# EAGLE design 1606_lora_module (EAGLE 9.6.2)
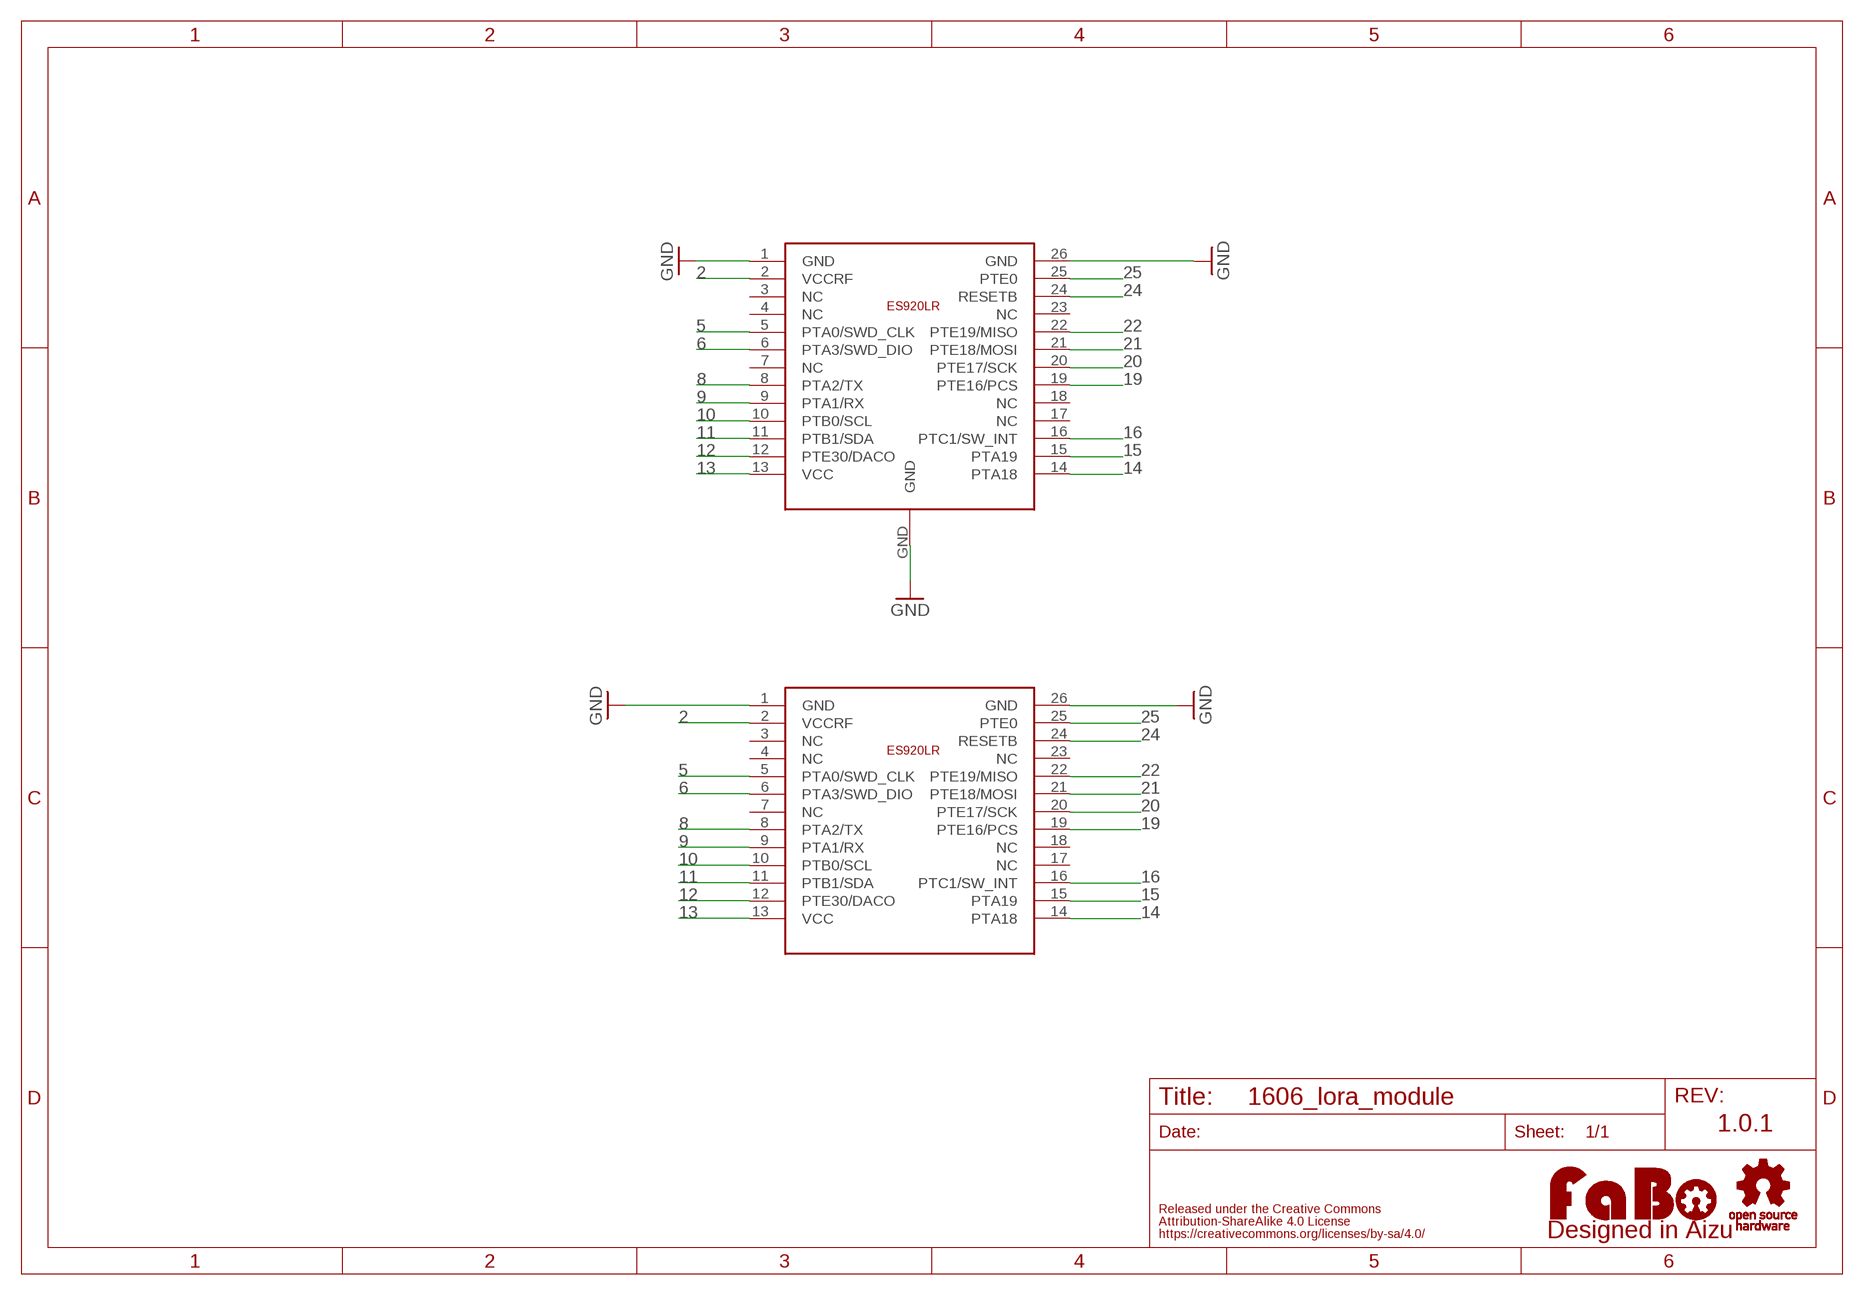
[diagram p0: schematic, sheet 1]

## Parts
U$2  ES920LR  [ES920LR]
U$3  ES920LR_MODULE  [MODULE]
U$4  LOGO_OSHW-M_BOTTOM  [LOGO_OSHW_M_BOTTOM]
U$5  LOGO_FABO-M_BOTTOM  [LOGO_FABO_MS_BOTTOM]

## Nets
2: U$2.2(VCCRF) U$3.2(VCCRF)
5: U$2.5(PTA0/SWD_CLK) U$3.5(PTA0/SWD_CLK)
6: U$2.6(PTA3/SWD_DIO) U$3.6(PTA3/SWD_DIO)
8: U$2.8(PTA2/TX) U$3.8(PTA2/TX)
9: U$2.9(PTA1/RX) U$3.9(PTA1/RX)
10: U$2.10(PTB0/SCL) U$3.10(PTB0/SCL)
11: U$2.11(PTB1/SDA) U$3.11(PTB1/SDA)
12: U$2.12(PTE30/DACO) U$3.12(PTE30/DACO)
13: U$2.13(VCC) U$3.13(VCC)
14: U$2.14(PTA18) U$3.14(PTA18)
15: U$2.15(PTA19) U$3.15(PTA19)
16: U$2.16(PTC1/SW_INT) U$3.16(PTC1/SW_INT)
19: U$2.19(PTE16/PCS) U$3.19(PTE16/PCS)
20: U$2.20(PTE17/SCK) U$3.20(PTE17/SCK)
21: U$2.21(PTE18/MOSI) U$3.21(PTE18/MOSI)
22: U$2.22(PTE19/MISO) U$3.22(PTE19/MISO)
24: U$2.24(RESETB) U$3.24(RESETB)
25: U$2.25(PTE0) U$3.25(PTE0)
GND: U$2.1(GND) U$2.26(GND) U$2.GND U$3.1(GND) U$3.26(GND)
Unconnected: U$2.3(NC) U$2.4(NC) U$2.7(NC) U$2.17(NC) U$2.18(NC) U$2.23(NC) U$3.3(NC) U$3.4(NC) U$3.7(NC) U$3.17(NC) U$3.18(NC) U$3.23(NC)

## Notes on the sheet
- 1.0.1

## Library data of the parts
U$2 = FaBo-LoRa:ES920LR
U$3 = FaBo-LoRa:ES920LR_MODULE
U$4 = FaBo-Logo:LOGO_OSHW
U$5 = FaBo-Logo:LOGO_FABO

## Board
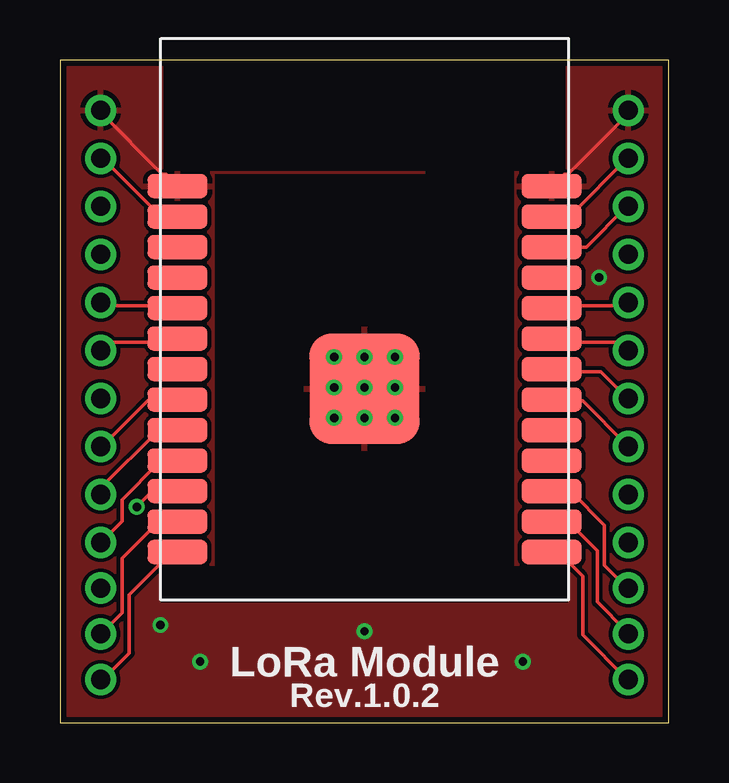
[diagram p1: board, top side]
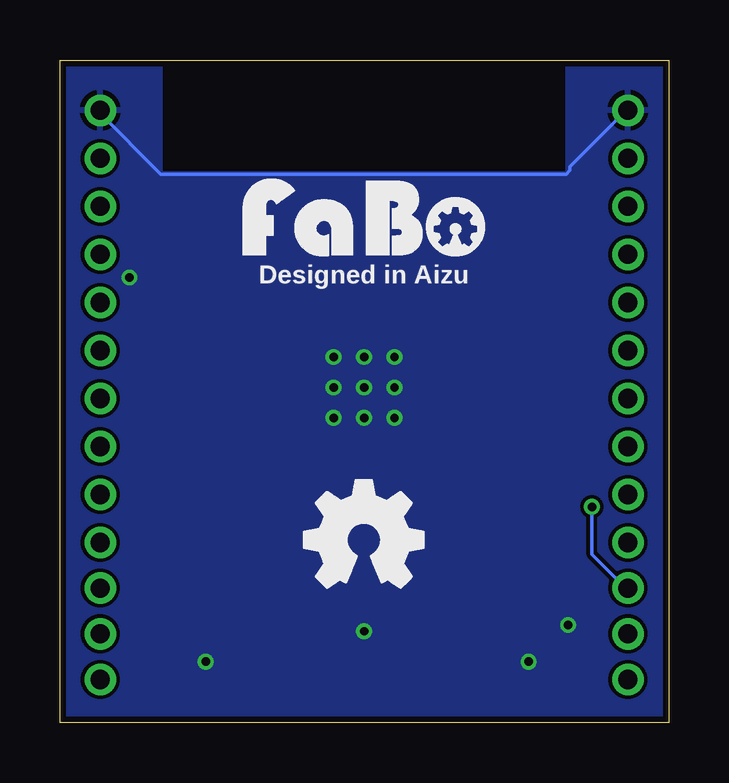
[diagram p2: board, bottom side, seen from below]

Size 25.38 x 27.61 mm. Coordinates in mm from the lower left corner, seen from the top.
Outline: 0,0 25.38,0 25.38,27.61 0,27.61 0,0
Copper layers (1*16): Top 0.035mm / dielectric 1.6mm / Bottom 0.035mm
Design rules "PCBway": minimum track width 6mil, minimum drill 12mil, track to track 6mil, track to pad 6mil, pad to pad 6mil, via to via 6mil, smd to smd 6mil, copper to edge 10mil, drill to drill 10mil, minimum pad ring 10mil, minimum via ring 6mil, stop-mask expansion 2mil, vias tented up to drill 100mil, thermal gap 8mil

### Footprints (pad centres in the part's own frame; a part is rotated, then mirrored left to right if it is on the bottom)
ES920LR = smd 2.5 x 1: 1 -7.8,5.84; 2 -7.8,4.57; 3 -7.8,3.3; 4 -7.8,2.03; 5 -7.8,0.76; 6 -7.8,-0.51; 7 -7.8,-1.78; 8 -7.8,-3.05; 9 -7.8,-4.32; 10 -7.8,-5.59; 11 -7.8,-6.86; 12 -7.8,-8.13; 13 -7.8,-9.4; 14 7.8,-9.4; 15 7.8,-8.13; 16 7.8,-6.86; 17 7.8,-5.59; 18 7.8,-4.32; 19 7.8,-3.05; 20 7.8,-1.78; 21 7.8,-0.51; 22 7.8,0.76; 23 7.8,2.03; 24 7.8,3.3; 25 7.8,4.57; 26 7.8,5.84 | smd 4.6 x 4.6: GND 0,-2.6
MODULE = drill 0.8 pad 1.27: 1 -11,9; 2 -11,7; 3 -11,5; 4 -11,3; 5 -11,1; 6 -11,-1; 7 -11,-3; 8 -11,-5; 9 -11,-7; 10 -11,-9; 11 -11,-10.905; 12 -11,-12.81; 13 -11,-14.715; 14 11,-14.715; 15 11,-12.81; 16 11,-10.905; 17 11,-9; 18 11,-7; 19 11,-5; 20 11,-3; 21 11,-1; 22 11,1; 23 11,3; 24 11,5; 25 11,7; 26 11,9

### Placement (x,y rotation side)
U$2  12.7,16.51 0 top
U$3  12.7,16.51 0 top
U$4  12.7,7.62 0 top
U$5  12.7,19.05 0 top

### Tracks (layer width: path | path; a pad name or v marks a point on that pad's centre or on a via)
2
  Top 0.152: U$2.2 4.88,21.18 4.12,21.18 1.83,23.47 U$3.2
5
  Top 0.152: U$2.5 4.88,17.37 1.83,17.37 U$3.5
6
  Top 0.152: U$2.6 4.88,15.85 2.13,15.85 1.83,15.54 U$3.6
8
  Top 0.152: U$2.8 4.88,13.41 3.66,13.41 1.83,11.58 U$3.8
9
  Top 0.152: U$2.9 4.88,12.04 3.96,12.04 1.83,9.91 1.83,9.6 U$3.9
10
  Top 0.152: U$2.10 4.88,10.82 4.12,10.82 2.59,9.3 2.59,8.38 1.83,7.62 U$3.10
11  (via drill 0.35)
  Top 0.152: v3.2,8.99 3.81,9.6 4.88,9.6 U$2.11
  Bottom 0.152: v3.2,8.99 3.2,7.01 1.83,5.64 U$3.11
12
  Top 0.152: U$2.12 4.88,8.23 3.96,8.23 2.59,6.86 2.59,4.57 1.83,3.81 U$3.12
13
  Top 0.152: U$2.13 4.88,7.01 4.57,7.01 2.9,5.33 2.9,2.9 1.83,1.83 U$3.13
14
  Top 0.152: U$2.14 20.57,7.01 20.88,7.01 21.79,6.1 21.79,3.66 23.62,1.83 U$3.14
15
  Top 0.152: U$2.15 20.57,8.23 21.34,8.23 22.4,7.16 22.4,5.03 23.62,3.81 U$3.15
16
  Top 0.152: U$2.16 20.57,9.6 21.34,9.6 22.71,8.23 22.71,6.55 23.62,5.64 U$3.16
19
  Top 0.152: U$2.19 20.57,13.41 21.79,13.41 23.62,11.58 U$3.19
20
  Top 0.152: U$2.20 20.57,14.63 22.55,14.63 23.62,13.56 U$3.20
21
  Top 0.152: U$2.21 20.57,15.85 23.32,15.85 23.62,15.54 U$3.21
22
  Top 0.152: U$2.22 20.57,17.37 23.62,17.37 U$3.22
24
  Top 0.152: U$2.24 20.57,19.81 21.95,19.81 23.62,21.49 U$3.24
25
  Top 0.152: U$2.25 20.57,21.18 21.34,21.18 23.62,23.47 U$3.25
GND  (via drill 0.35)
  Top 0.152: U$2.1 4.88,22.4 4.42,22.86 4.27,22.86 1.68,25.45 U$3.1 | U$2.26 20.57,22.4 21.03,22.86 21.18,22.86 23.77,25.45 U$3.26
  Bottom 0.152: U$3.1 1.83,25.45 4.12,23.16 4.12,23.01 4.27,22.86 21.18,22.86 23.77,25.45 U$3.26
  other vias: 11.43,15.24 12.7,15.24 13.97,15.24 13.97,13.97 12.7,13.97 11.43,13.97 11.43,12.7 12.7,12.7 13.97,12.7 5.84,2.54 12.7,3.81 19.3,2.54 22.48,18.54 4.19,4.06
  pour Top: 0,0 25.4,0 25.4,27.94 0,27.94
  pour Bottom: 0,0 25.4,0 25.4,27.94 0,27.94

### Text on the board
tPlace: LoRa Module | Rev.1.0.2
bPlace: Designed in Aizu